# EAGLE design lens controller2 (EAGLE 6.1)
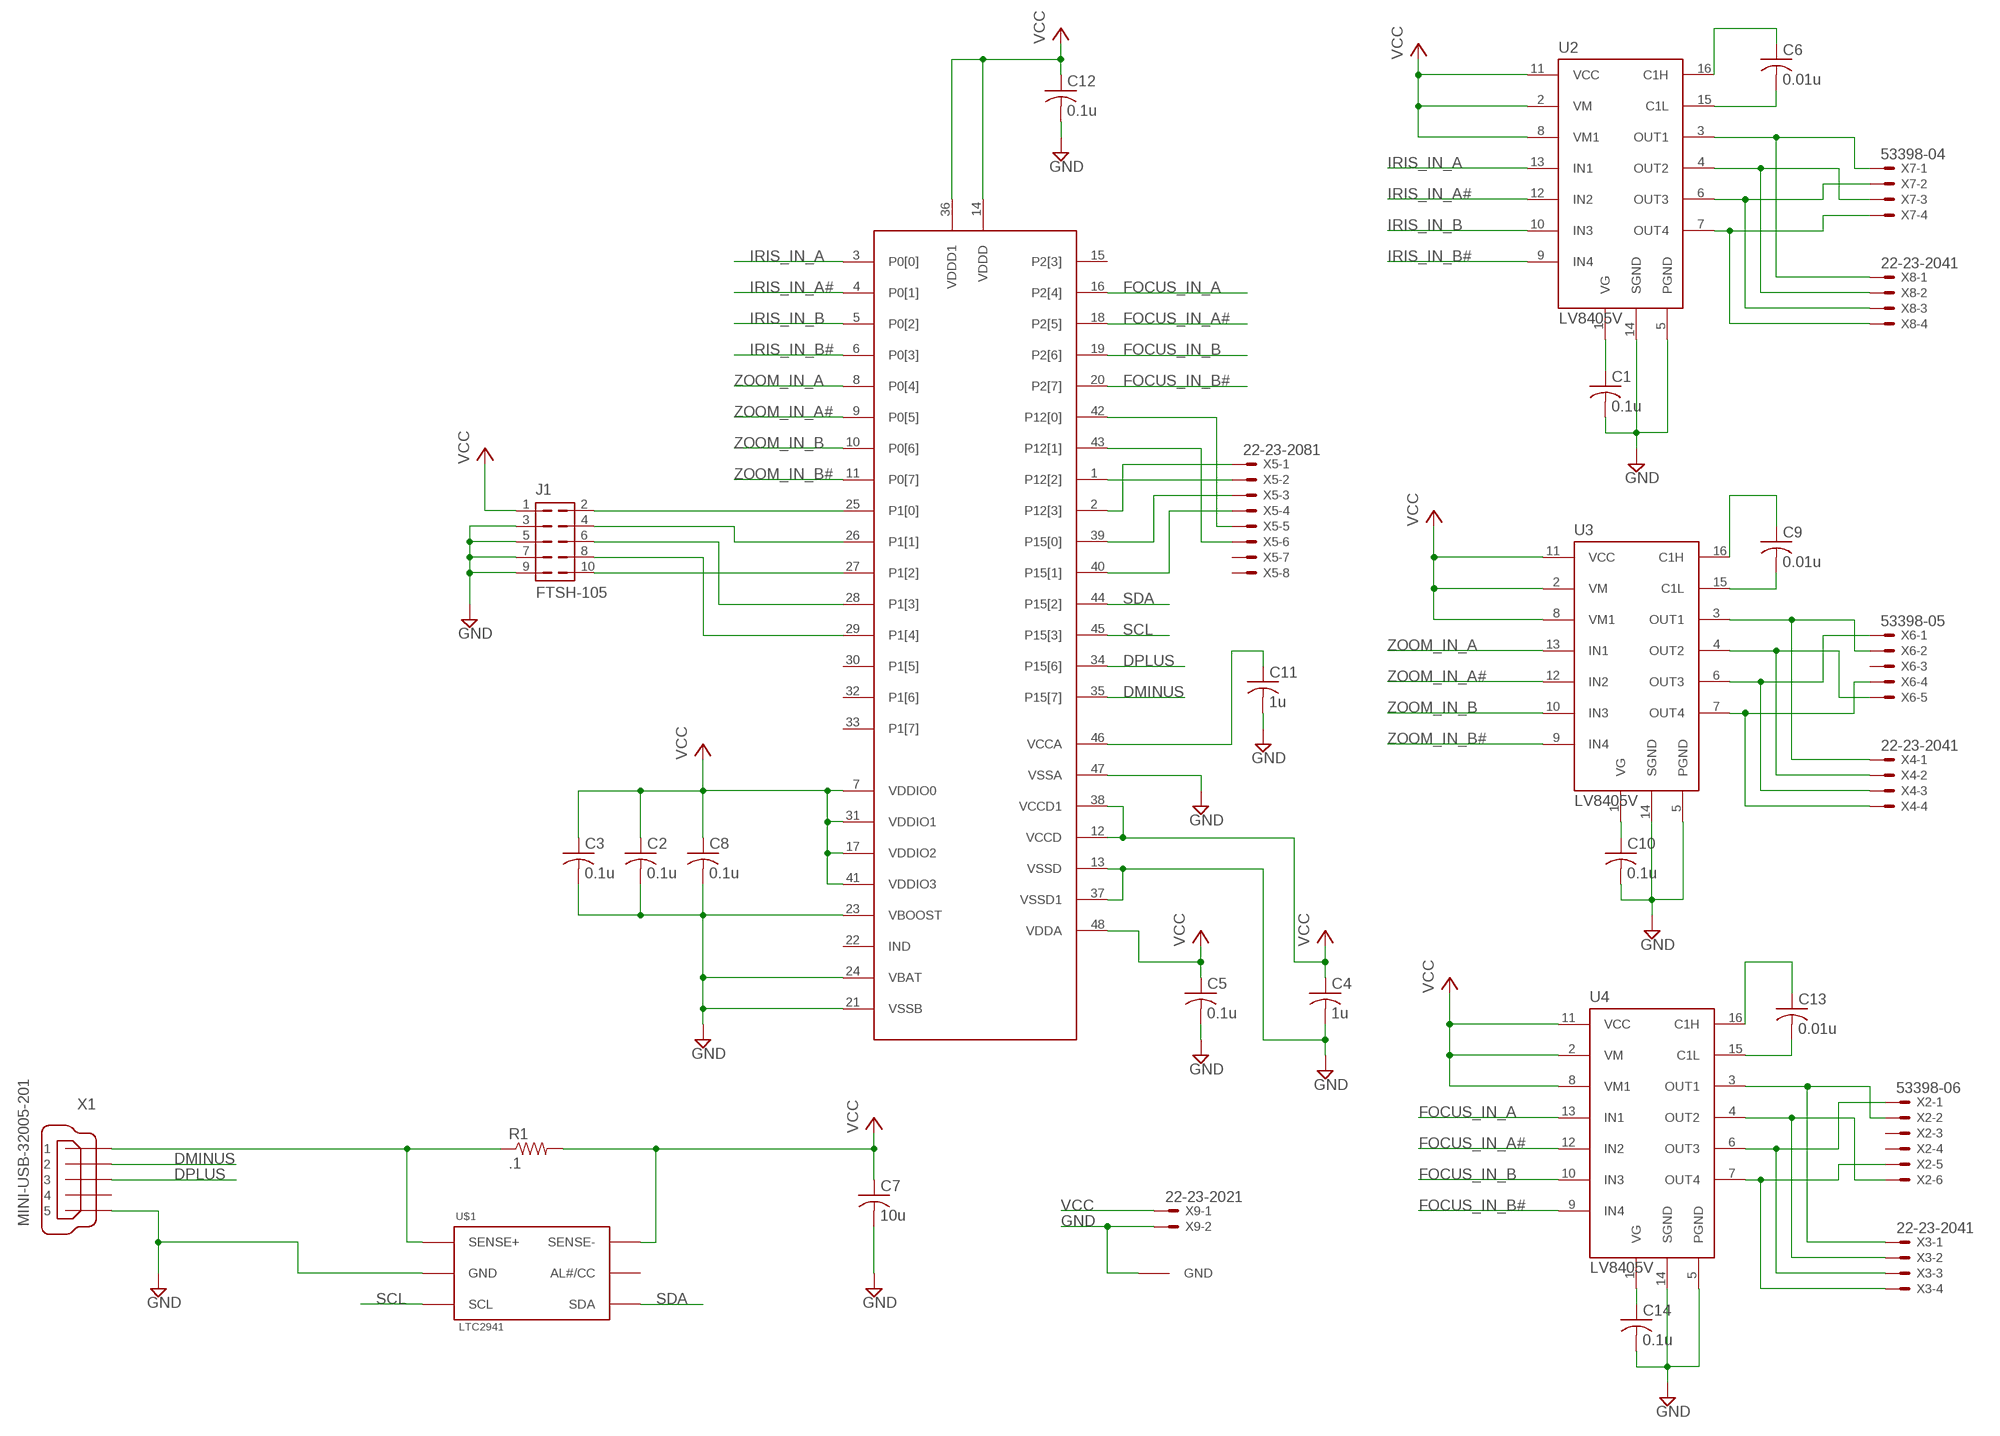
[diagram p0: schematic, sheet 1]

## Parts
C1  0.1u  C-USC1206  [C1206]
C2  0.1u  C-USC1206  [C1206]
C3  0.1u  C-USC1206  [C1206]
C4  1u  C-USC1206  [C1206]
C5  0.1u  C-USC1206  [C1206]
C6  0.01u  C-USC1206  [C1206]
C7  10u  C-USC1206  [C1206]
C8  0.1u  C-USC1206  [C1206]
C9  0.01u  C-USC1206  [C1206]
C10  0.1u  C-USC1206  [C1206]
C11  1u  C-USC1206  [C1206]
C12  0.1u  C-USC1206  [C1206]
C13  0.01u  C-USC1206  [C1206]
C14  0.1u  C-USC1206  [C1206]
J1  FTSH-105  [FTSH-105-01-XXX-DV-K]
R1  .1  R-US_M1206  [M1206]
U1  CY8C3246PVI  [SSOP48B]
U2  LV8405V  [SSOP16]
U3  LV8405V  [SSOP16]
U4  LV8405V  [SSOP16]
U$1  LTC2941  [DFN6-2X3]
U$5  GND_LUG  [GND_PAD]
X1  MINI-USB-32005-201  [32005-201]
X2  53398-06  [53398-06]
X3  22-23-2041  [22-23-2041]
X4  22-23-2041  [22-23-2041]
X5  22-23-2081  [22-23-2081]
X6  53398-05  [53398-05]
X7  53398-04  [53398-04]
X8  22-23-2041  [22-23-2041]
X9  22-23-2021  [22-23-2021]

## Nets
DMINUS: U1.35(P15[7]) X1.2
DPLUS: U1.34(P15[6]) X1.3
FOCUS_IN_A: U1.16(P2[4]) U4.13(IN1)
FOCUS_IN_A#: U1.18(P2[5]) U4.12(IN2)
FOCUS_IN_B: U1.19(P2[6]) U4.10(IN3)
FOCUS_IN_B#: U1.20(P2[7]) U4.9(IN4)
GND: C1.2 C2.2 C3.2 C4.2 C5.2 C7.2 C8.2 C10.2 C11.2 C12.2 C14.2 J1.3 J1.5 J1.7 J1.9 U1.13(VSSD) U1.21(VSSB) U1.23(VBOOST) U1.24(VBAT) U1.37(VSSD1) U1.47(VSSA) U2.5(PGND) U2.14(SGND) U3.5(PGND) U3.14(SGND) U4.5(PGND) U4.14(SGND) U$1.2(GND) U$5.P$1(GND) X1.5 X9.2
IRIS_IN_A: U1.3(P0[0]) U2.13(IN1)
IRIS_IN_A#: U1.4(P0[1]) U2.12(IN2)
IRIS_IN_B: U1.5(P0[2]) U2.10(IN3)
IRIS_IN_B#: U1.6(P0[3]) U2.9(IN4)
N$1: J1.2 U1.25(P1[0])
N$2: J1.4 U1.26(P1[1])
N$3: J1.10 U1.27(P1[2])
N$4: J1.6 U1.28(P1[3])
N$5: J1.8 U1.29(P1[4])
N$6: C11.1 U1.46(VCCA)
N$7: C6.2 U2.15(C1L)
N$8: C6.1 U2.16(C1H)
N$9: C1.1 U2.1(VG)
N$10: C9.2 U3.15(C1L)
N$11: C9.1 U3.16(C1H)
N$12: C10.1 U3.1(VG)
N$13: U2.3(OUT1) X7.1 X8.1
N$14: U2.4(OUT2) X7.3 X8.2
N$15: C13.2 U4.15(C1L)
N$16: C13.1 U4.16(C1H)
N$17: C14.1 U4.1(VG)
N$18: U2.6(OUT3) X7.2 X8.3
N$19: U2.7(OUT4) X7.4 X8.4
N$20: U3.3(OUT1) X4.1 X6.2
N$21: U3.4(OUT2) X4.2 X6.5
N$22: U3.6(OUT3) X4.3 X6.1
N$23: U3.7(OUT4) X4.4 X6.4
N$24: U4.3(OUT1) X2.2 X3.1
N$25: U4.4(OUT2) X2.6 X3.2
N$26: U4.6(OUT3) X2.1 X3.3
N$27: U4.7(OUT4) X2.5 X3.4
N$28: U1.43(P12[1]) X5.6
N$29: U1.42(P12[0]) X5.5
N$30: U1.40(P15[1]) X5.4
N$31: U1.39(P15[0]) X5.3
N$32: U1.2(P12[3]) X5.1
N$33: U1.1(P12[2]) X5.2
N$38: R1.1 U$1.1(SENSE+) X1.1
SCL: U1.45(P15[3]) U$1.3(SCL)
SDA: U1.44(P15[2]) U$1.4(SDA)
VCC: C2.1 C3.1 C4.1 C5.1 C7.1 C8.1 C12.1 J1.1 R1.2 U1.7(VDDIO0) U1.12(VCCD) U1.14(VDDD) U1.17(VDDIO2) U1.31(VDDIO1) U1.36(VDDD1) U1.38(VCCD1) U1.41(VDDIO3) U1.48(VDDA) U2.2(VM) U2.8(VM1) U2.11(VCC) U3.2(VM) U3.8(VM1) U3.11(VCC) U4.2(VM) U4.8(VM1) U4.11(VCC) U$1.6(SENSE-) X9.1
ZOOM_IN_A: U1.8(P0[4]) U3.13(IN1)
ZOOM_IN_A#: U1.9(P0[5]) U3.12(IN2)
ZOOM_IN_B: U1.10(P0[6]) U3.10(IN3)
ZOOM_IN_B#: U1.11(P0[7]) U3.9(IN4)
Unconnected: U1.15(P2[3]) U1.22(IND) U1.30(P1[5]) U1.32(P1[6]) U1.33(P1[7]) U$1.5(AL#/CC) X1.4 X2.3 X2.4 X5.7 X5.8 X6.3

## Library data of the parts
C1-C14 = resistor:C-US: CAPACITOR, American symbol
J1 = NicksParts:FTSH-105
R1 = resistor:R-US_: RESISTOR, American symbol
U1 = NicksParts:CY8C3246PVI
U2-U4 = NicksParts:LV8405V
U$1 = NicksParts:LTC2941
U$5 = NicksParts:GND_LUG
X1 = con-cypressindustries:MINI-USB-: MINI USB-B Conector Source: www.cypressindustries.com; OC_FARNELL: unknown; OC_NEWARK: unknown
X2 = con-molex:53?-06: CONNECTOR wire to board 1.25 mm (.049 inch) pitch header; OC_FARNELL: 1125368; OC_NEWARK: unknown
X3 X4 X8 = con-molex:22-23-2041: .100" (2.54mm) Center Header - 4 Pin; MF: MOLEX; MPN: 22-23-2041; OC_FARNELL: 1462920; OC_NEWARK: 38C0355
X5 = con-molex:22-23-2081: .100" (2.54mm) Center Header - 8 Pin; MF: MOLEX; MPN: 22-23-2081; OC_FARNELL: 1756826; OC_NEWARK: 01C7592
X6 = con-molex:53?-05: CONNECTOR wire to board 1.25 mm (.049 inch) pitch header; OC_FARNELL: 1125354; OC_NEWARK: unknown
X7 = con-molex:53?-04: CONNECTOR wire to board 1.25 mm (.049 inch) pitch header; OC_FARNELL: 1125367; OC_NEWARK: unknown
X9 = con-molex:22-23-2021: .100" (2.54mm) Center Header - 2 Pin; MF: MOLEX; MPN: 22-23-2021; OC_FARNELL: 1462926; OC_NEWARK: 25C3832

## Board
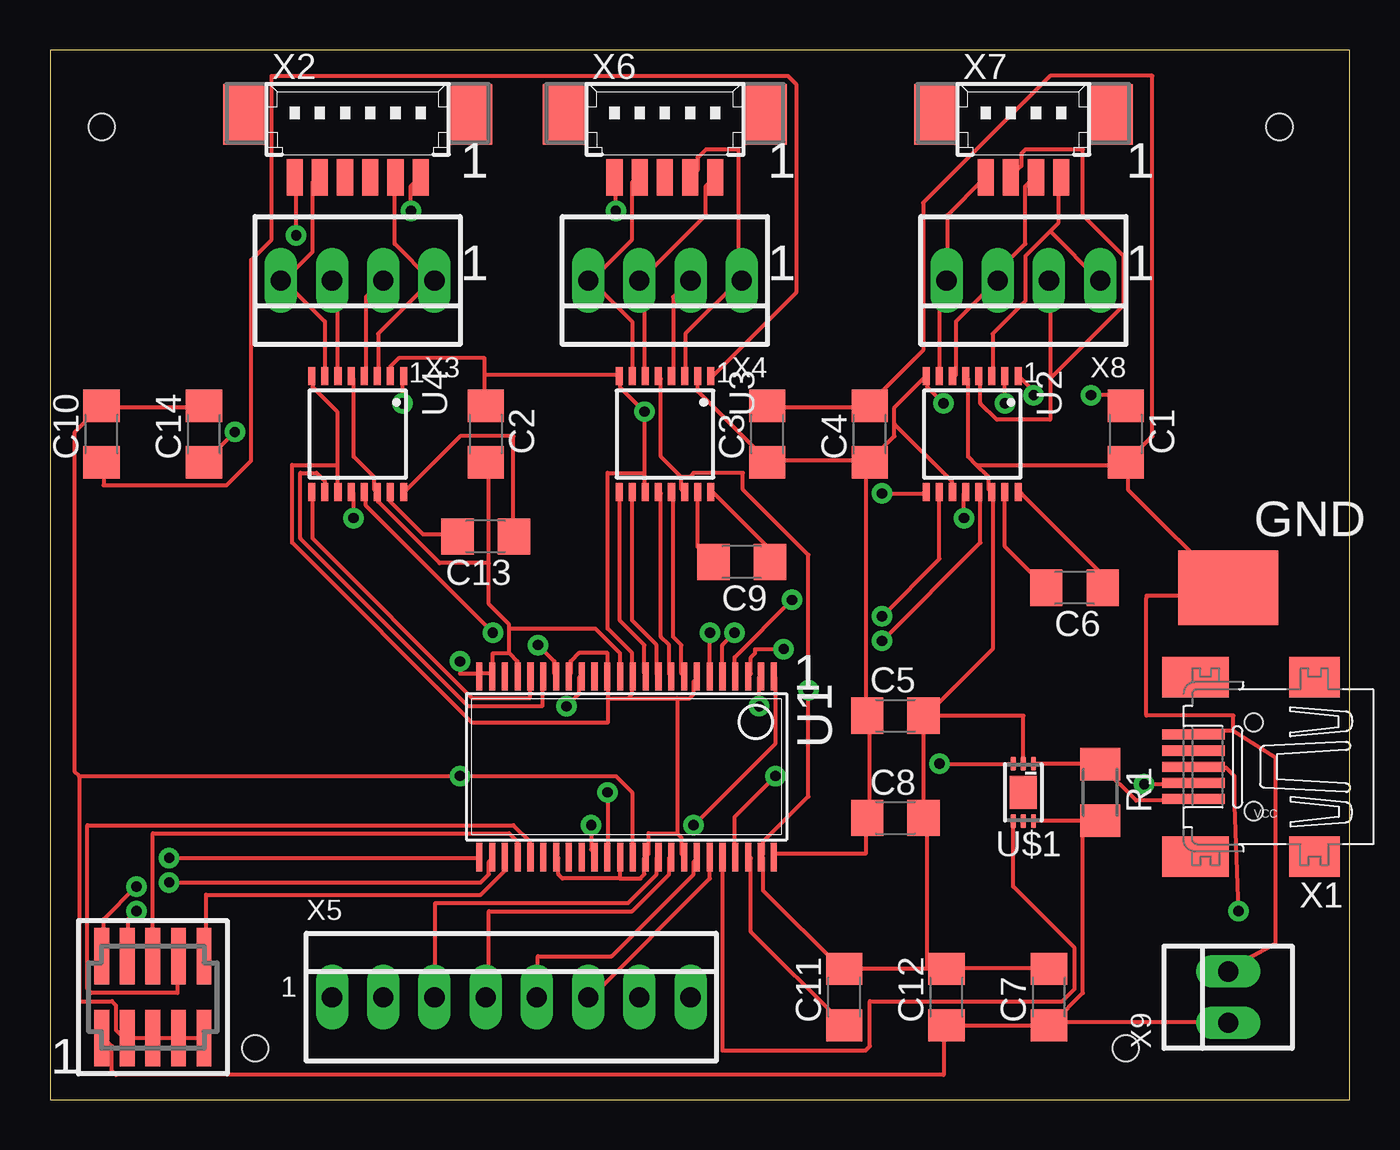
[diagram p1: board, top side]
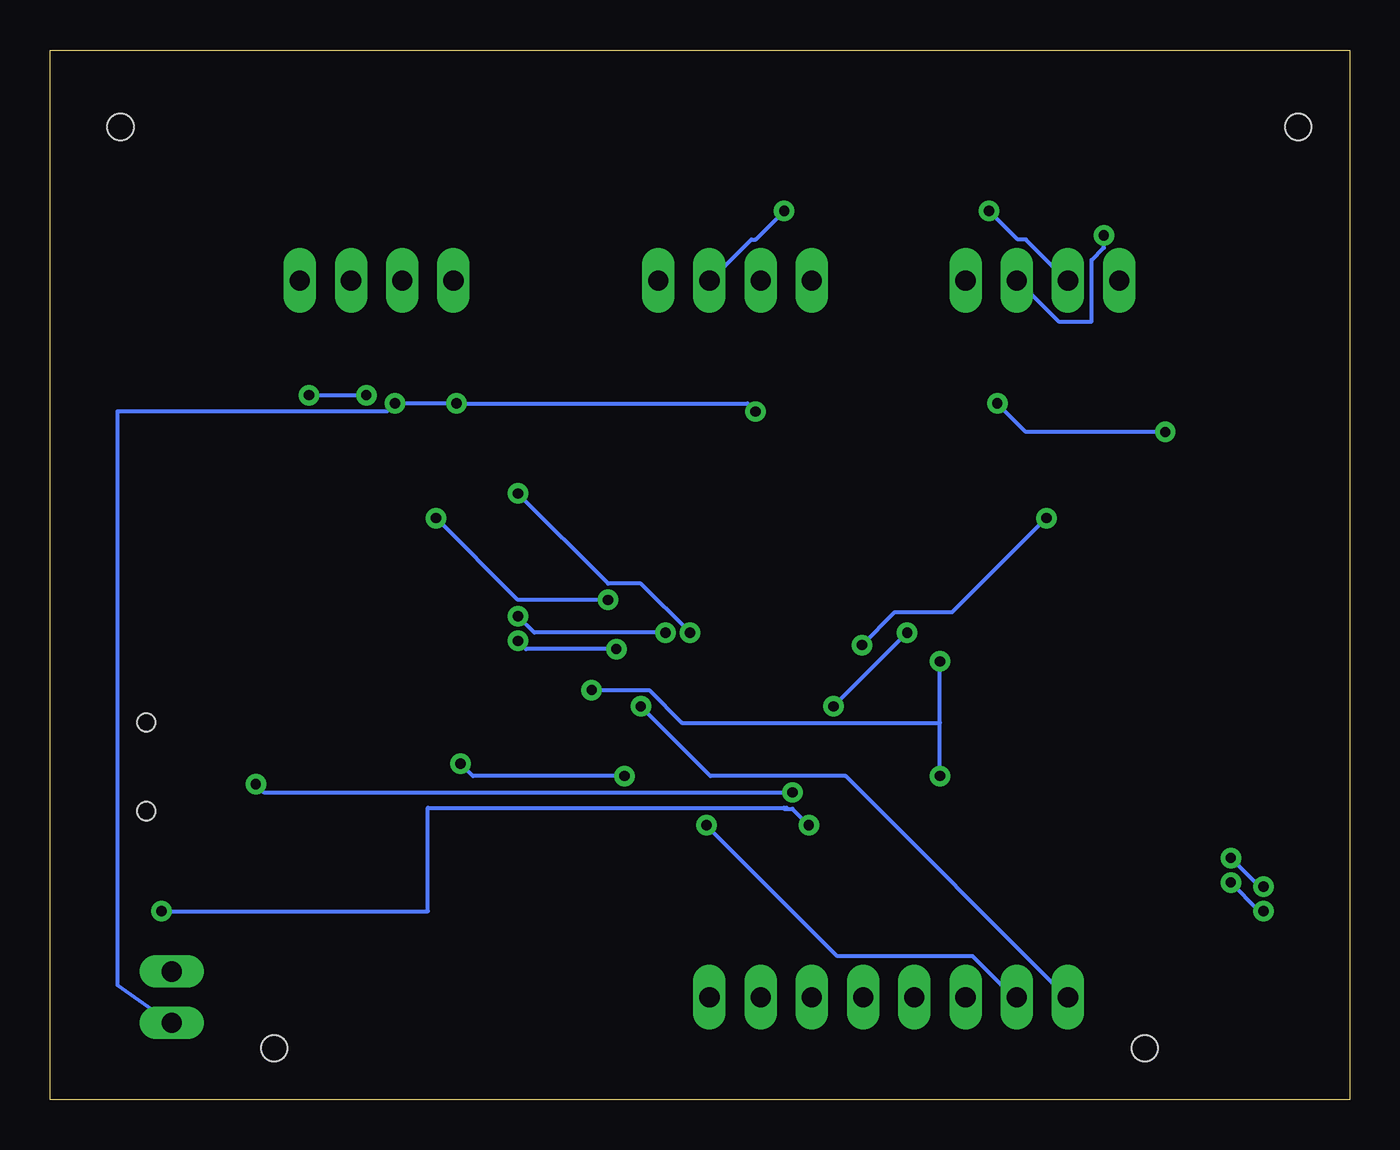
[diagram p2: board, bottom side, seen from below]

Size 64.44 x 52.06 mm. Coordinates in mm from the lower left corner, seen from the top.
Outline: 0,0 64.44,0 64.44,52.06 0,52.06 0,0
Copper layers (1*16): Top 0.035mm / dielectric 1.5mm / Bottom 0.035mm
Design rules: minimum track width 8mil, minimum drill 20mil, track to track 8mil, track to pad 8mil, pad to pad 8mil, via to via 8mil, smd to smd 8mil, copper to edge 10mil, drill to drill 8mil, minimum pad ring 12mil, minimum via ring 10mil, stop-mask expansion 4mil, vias tented up to drill 25mil, thermal gap 10mil
Holes 1.3 mm at 2.54,48.26 60.96,48.26 53.34,2.54 10.16,2.54

### Footprints (pad centres in the part's own frame; a part is rotated, then mirrored left to right if it is on the bottom)
C1206 = smd 1.6 x 1.8: 1 -1.4,0; 2 1.4,0
FTSH-105-01-XXX-DV-K = smd 0.737 x 2.794: 1 -2.54,-2.032; 2 -2.54,2.032; 3 -1.27,-2.032; 4 -1.27,2.032; 5 0,-2.032; 6 0,2.032; 7 1.27,-2.032; 8 1.27,2.032; 9 2.54,-2.032; 10 2.54,2.032
M1206 = smd 1.6 x 2: 1 -1.4,0; 2 1.4,0
SSOP48B = smd 0.305 x 1.397: 1 -6.668,-4.483; 2 -6.032,-4.483; 3 -5.397,-4.483; 4 -4.763,-4.483; 5 -4.128,-4.483; 6 -3.493,-4.483; 7 -2.857,-4.483; 8 -2.223,-4.483; 9 -1.587,-4.483; 10 -0.953,-4.483; 11 -0.318,-4.483; 12 0.318,-4.483; 13 0.953,-4.483; 14 1.587,-4.483; 15 2.223,-4.483; 16 2.857,-4.483; 17 3.493,-4.483; 18 4.128,-4.483; 19 4.763,-4.483; 20 5.397,-4.483; 21 6.032,-4.483; 22 6.668,-4.483; 23 7.303,-4.483; 24 7.938,-4.483; 25 7.938,4.483; 26 7.303,4.483; 27 6.668,4.483; 28 6.032,4.483; 29 5.397,4.483; 30 4.763,4.483; 31 4.128,4.483; 32 3.493,4.483; 33 2.857,4.483; 34 2.223,4.483; 35 1.587,4.483; 36 0.953,4.483; 37 0.318,4.483; 38 -0.318,4.483; 39 -0.953,4.483; 40 -1.587,4.483; 41 -2.223,4.483; 42 -2.857,4.483; 43 -3.493,4.483; 44 -4.128,4.483; 45 -4.763,4.483; 46 -5.397,4.483; 47 -6.032,4.483; 48 -6.668,4.483
SSOP16 = smd 0.9 x 0.35: 1 -2.875,2.275; 2 -2.875,1.625; 3 -2.875,0.975; 4 -2.875,0.325; 5 -2.875,-0.325; 6 -2.875,-0.975; 7 -2.875,-1.625; 8 -2.875,-2.275; 9 2.875,-2.275; 10 2.875,-1.625; 11 2.875,-0.975; 12 2.875,-0.325; 13 2.875,0.325; 14 2.875,0.975; 15 2.875,1.625; 16 2.875,2.275
DFN6-2X3 = smd 0.25 x 0.7: 1 -0.5,-1.425; 2 0,-1.425; 3 0.5,-1.425; 4 0.5,1.425; 5 0,1.425; 6 -0.5,1.425 | smd 1.35 x 1.65: EXP 0,0
GND_PAD = smd 4.953 x 3.683: P$1 0,0
32005-201 = smd 3.1 x 0.5: 1 3,1.6; 2 3,0.8; 3 3,0; 4 3,-0.8; 5 3,-1.6 | smd 2.5 x 2: M1 -3,-4.45; M2 -3,4.45 | smd 3.3 x 2: M3 2.9,4.45; M4 2.9,-4.45 | hole 0.9: 0,2.2; 0,-2.2
53398-06 = smd 0.8 x 1.8: 1 3.125,-2.5; 2 1.875,-2.5; 3 0.625,-2.5; 4 -0.625,-2.5; 5 -1.875,-2.5; 6 -3.125,-2.5 | smd 2.1 x 3: S1 5.625,0.625; S2 -5.625,0.625
22-23-2041 = drill 1 long: 1 -3.81,0; 2 -1.27,0; 3 1.27,0; 4 3.81,0
22-23-2081 = drill 1 long: 1 -8.89,0; 2 -6.35,0; 3 -3.81,0; 4 -1.27,0; 5 1.27,0; 6 3.81,0; 7 6.35,0; 8 8.89,0
53398-05 = smd 0.8 x 1.8: 1 2.5,-2.5; 2 1.25,-2.5; 3 0,-2.5; 4 -1.25,-2.5; 5 -2.5,-2.5 | smd 2.1 x 3: S1 5,0.625; S2 -5,0.625
53398-04 = smd 0.8 x 1.8: 1 1.875,-2.5; 2 0.625,-2.5; 3 -0.625,-2.5; 4 -1.875,-2.5 | smd 2.1 x 3: S1 4.375,0.625; S2 -4.375,0.625
22-23-2021 = drill 1 long: 1 -1.27,0; 2 1.27,0

### Placement (x,y rotation side)
C1  53.34,33.02 270 top
C2  21.59,33.02 270 top
C3  35.56,33.02 90 top
C4  40.64,33.02 90 top
C5  41.91,19.05 0 top
C6  50.8,25.4 180 top
C7  49.53,5.08 90 top
C8  41.91,13.97 0 top
C9  34.29,26.67 180 top
C10  2.54,33.02 90 top
C11  39.37,5.08 90 top
C12  44.45,5.08 90 top
C13  21.59,27.94 180 top
C14  7.62,33.02 90 top
J1  5.08,5.08 0 top
R1  52.07,15.24 270 top
U1  29.21,16.51 180 top
U2  45.72,33.02 270 top
U3  30.48,33.02 270 top
U4  15.24,33.02 270 top
U$1  48.26,15.24 180 top
U$5  58.42,25.4 0 top
X1  59.69,16.51 180 top
X2  15.24,48.26 0 top
X3  15.24,40.64 180 top
X4  30.48,40.64 180 top
X5  22.86,5.08 0 top
X6  30.48,48.26 0 top
X7  48.26,48.26 0 top
X8  48.26,40.64 180 top
X9  58.42,5.08 90 top

### Tracks (layer width: path | path; a pad name or v marks a point on that pad's centre or on a via)
DMINUS  (via drill 0.51)
  Top 0.203: v27.64,15.24 27.64,12.19 U1.35 | v54.25,15.65 56.49,15.65 X1.2
  Bottom 0.203: v27.64,15.24 53.85,15.24 v54.25,15.65
DPLUS  (via drill 0.51)
  Top 0.203: v26.82,13.61 26.82,12.39 27.03,12.19 U1.34 | v58.93,9.35 58.73,14.63 58.73,16.05 58.32,16.46 56.69,16.46 X1.3
  Bottom 0.203: v26.82,13.61 27.64,14.43 28.04,14.43 28.04,14.48 | v58.93,9.35 45.72,9.35 45.72,14.48 28.04,14.48 | 28.04,14.48 27.94,14.48
FOCUS_IN_A  (via drill 0.51)
  Top 0.203: v21.95,23.16 15.65,29.46 15.65,30.07 U4.13 | v25.6,19.51 26.21,20.12 26.21,20.93 U1.16
  Bottom 0.203: v25.6,19.51 v21.95,23.16
FOCUS_IN_A#  (via drill 0.51)
  Top 0.203: v15.04,28.85 15.04,30.07 U4.12 | v24.18,22.55 24.99,21.74 24.99,21.13 U1.18
  Bottom 0.203: v15.04,28.85 19.71,24.18 22.55,24.18 v24.18,22.55
FOCUS_IN_B
  Top 0.203: U4.10 13.61,30.28 13.61,30.68 13.21,31.09 12.39,31.09 12.39,27.84 20.73,19.51 24.38,19.51 24.38,20.93 U1.19
FOCUS_IN_B#
  Top 0.203: U4.9 13.01,30.07 13.01,27.84 20.93,19.91 23.77,19.91 23.77,20.93 U1.20
GND  (via drill 0.51)
  Top 0.203: U4.5 15.04,35.76 15.04,31.9 16.05,30.89 16.05,30.28 U4.14 16.26,30.07 16.26,29.67 19.3,26.62 21.74,26.62 | 21.95,21.13 21.34,21.13 U1.24 21.13,21.13 20.32,21.13 v20.32,21.74 | 21.95,21.13 U1.23 21.95,21.13 | 22.76,22.15 23.16,21.74 23.16,21.13 U1.21 | 22.76,22.15 21.95,22.15 21.95,21.13 | 22.76,23.37 27.03,23.37 28.25,22.15 28.25,21.13 U1.13 | 22.76,22.15 22.76,23.37 | 21.74,26.62 21.74,24.59 22.76,23.57 22.76,23.37 | 21.74,26.62 21.74,31.5 C2.2 | C14.2 7.52,34.34 2.64,34.34 C10.2 2.44,34.34 1.22,33.12 1.22,16.26 1.42,16.05 | 6.5,3.05 J1.7 | 7.52,3.05 J1.9 7.52,3.05 | 1.42,16.05 v20.32,16.05 28.04,16.05 28.85,15.24 28.85,12.19 U1.37 | 3.86,3.05 J1.3 | C5.2 43.28,18.9 43.28,14.02 C8.2 43.48,13.82 43.48,6.5 | C7.2 49.38,6.5 44.5,6.5 C12.2 44.3,6.5 43.48,6.5 | 31.29,30.89 30.28,31.9 30.28,35.76 U3.5 | 31.29,30.89 31.29,30.28 U3.14 | 31.29,30.89 31.7,30.89 31.9,31.09 34.34,31.09 34.34,30.28 37.59,27.03 v37.59,20.32 37.59,15.04 35.36,12.8 35.36,12.19 U1.47 35.36,11.99 35.36,10.36 39.22,6.5 C11.2 39.42,6.5 43.48,6.5 | 58.67,18.29 56.69,18.29 X1.5 | 58.67,18.29 60.76,16.97 60.76,7.72 58.52,6.5 X9.2 | C3.2 35.56,34.34 40.64,34.34 C4.2 40.64,34.54 43.28,37.19 43.28,44.5 49.58,50.8 54.66,50.8 54.66,32.92 53.44,31.7 C1.2 | 45.92,31.5 46.53,30.89 46.53,30.28 U2.14 46.74,30.07 46.74,22.35 43.48,19.1 | 45.92,31.5 45.52,31.9 45.52,35.76 U2.5 | 45.92,31.5 53.24,31.5 C1.2 | C1.2 53.44,31.5 53.44,30.28 58.32,25.4 U$5.P$1 58.52,25.4 58.93,24.99 54.36,24.99 54.36,24.89 54.36,19.05 58.67,19.05 58.67,18.29 | 43.48,19.1 C5.2 | U$1.2 48.26,19.05 43.48,19.05 | 43.43,19.05 43.48,19.05
  Top 0.203: 43.48,19.1 43.48,19.05 | 43.48,19.1 C5.2 | 3.86,3.05 J1.5 6.3,3.05 J1.7 | 3.86,3.05 J1.3 | 7.52,3.05 6.5,3.05 | 6.5,3.05 J1.7 | 1.42,16.05 1.42,4.88 3.05,4.88 3.25,4.67 3.25,3.45 3.66,3.05 J1.3
  Bottom 0.203: v20.32,16.05 20.32,18.69 | 20.32,18.69 v20.32,21.74 | 20.32,18.69 33.12,18.69 34.75,20.32 v37.59,20.32
IRIS_IN_A  (via drill 0.51)
  Top 0.203: v41.25,22.76 46.13,27.64 46.13,30.07 U2.13 | v36.37,22.35 34.95,22.35 34.95,22.15 34.75,21.95 34.75,21.13 U1.3
  Bottom 0.203: v41.25,22.76 40.84,22.35 v36.37,22.35
IRIS_IN_A#  (via drill 0.51)
  Top 0.203: v45.31,28.85 45.31,30.07 U2.12 | v36.78,24.79 33.93,21.95 33.93,21.13 U1.4
  Bottom 0.203: v45.31,28.85 41.25,24.79 v36.78,24.79
IRIS_IN_B  (via drill 0.51)
  Top 0.203: v41.25,23.98 44.09,26.82 44.09,30.07 U2.10 | v33.93,23.16 33.33,22.55 33.33,21.13 U1.5
  Bottom 0.203: v41.25,23.98 40.44,23.16 v33.93,23.16
IRIS_IN_B#  (via drill 0.51)
  Top 0.203: v41.25,30.07 43.28,30.07 U2.9 | v32.72,23.16 32.72,21.13 U1.6
  Bottom 0.203: v41.25,30.07 36.78,25.6 35.15,25.6 v32.72,23.16
N$1  (via drill 0.51)
  Top 0.203: v5.89,11.99 21.13,11.99 U1.25 | v4.27,10.57 2.64,8.94 2.64,7.11 J1.2
  Bottom 0.203: v5.89,11.99 4.47,10.57 v4.27,10.57
N$2  (via drill 0.51)
  Top 0.203: v5.89,10.77 21.34,10.77 21.74,11.18 21.74,11.79 21.95,11.99 U1.26 | v4.27,9.35 3.86,8.94 3.86,7.11 J1.4
  Bottom 0.203: v5.89,10.77 4.47,9.35 v4.27,9.35
N$3
  Top 0.203: U1.27 22.55,11.99 22.55,11.38 21.34,10.16 7.72,10.16 7.72,7.11 J1.10
N$4
  Top 0.203: J1.6 5.08,13.21 22.76,13.21 23.16,12.8 23.16,12.19 U1.28
N$5
  Top 0.203: U1.29 23.77,12.19 23.77,12.8 22.96,13.61 1.83,13.61 1.83,5.49 2.03,5.28 6.3,5.28 6.3,7.11 J1.8
N$6
  Top 0.203: U1.46 34.75,11.99 34.75,8.33 39.22,3.86 C11.1
N$7
  Top 0.203: U2.15 47.35,30.07 47.35,27.43 49.38,25.4 C6.2
N$8
  Top 0.203: U2.16 48.16,30.07 52.02,26.21 52.02,25.4 C6.1
N$9  (via drill 0.51)
  Top 0.203: v48.77,34.95 48.77,35.15 48.16,35.76 U2.1 | v51.61,34.95 53.24,34.95 53.24,34.54 C1.1
  Bottom 0.203: v51.61,34.95 v48.77,34.95
N$10
  Top 0.203: U3.15 32.11,30.07 32.11,27.43 32.72,26.82 C9.2
N$11
  Top 0.203: U3.16 32.92,30.07 35.56,27.43 35.56,26.82 C9.1
N$12
  Top 0.203: U3.1 32.92,35.97 36.98,40.03 36.98,50.39 36.58,50.8 10.97,50.8 10.97,42.67 9.96,41.66 9.96,31.7 8.74,30.48 2.64,30.48 2.64,31.5 C10.1
N$13
  Top 0.203: 49.58,43.08 49.99,43.48 49.99,45.72 X7.1 | 49.58,43.08 48.36,41.86 48.36,39.62 46.74,38 46.74,35.97 U2.3 | 49.58,43.08 52.02,40.64 X8.1
N$14
  Top 0.203: 49.58,35.76 49.58,40.64 X8.2 | 49.58,35.76 49.58,33.73 46.94,33.73 46.13,34.54 46.13,35.76 U2.4 | 49.58,35.76 53.24,39.42 53.24,41.86 51.21,43.89 51.21,47.14 48.36,47.14 48.16,46.94 48.16,46.33 47.75,45.92 X7.3
N$15
  Top 0.203: U4.15 16.87,30.07 16.87,29.67 18.49,28.04 20.12,28.04 C13.2
N$16
  Top 0.203: U4.16 17.68,30.28 20.32,32.92 22.96,32.92 22.96,28.04 C13.1
N$17  (via drill 0.51)
  Top 0.203: v17.48,34.54 17.48,35.76 U4.1 | v9.14,33.12 7.72,31.7 C14.1
  Bottom 0.203: v17.48,34.54 16.05,33.12 v9.14,33.12
N$18
  Top 0.203: U2.6 44.91,35.97 44.91,38.61 46.94,40.64 X8.3 47.14,40.64 47.14,41.25 48.36,42.47 48.36,45.31 48.77,45.72 X7.2
N$19
  Top 0.203: U2.7 44.09,35.97 44.09,40.44 44.3,40.64 X8.4 44.5,40.64 44.5,43.89 46.33,45.72 X7.4
N$20
  Top 0.203: 34.14,40.64 31.5,38 31.5,35.97 U3.3 | 34.14,40.64 X4.1 34.14,40.64 | 34.14,40.64 34.14,47.14 32.51,47.14 32.11,46.74 32.11,46.13 31.9,45.92 X6.2
N$21  (via drill 0.51)
  Top 0.203: U3.4 30.89,35.97 30.89,39.83 31.7,40.64 X4.2 | v28.04,44.09 28.04,45.72 X6.5
  Bottom 0.203: v28.04,44.09 29.46,42.67 29.67,42.67 31.7,40.64 X4.2
N$22
  Top 0.203: 29.26,40.64 29.46,40.44 29.46,35.97 U3.6 | 29.26,40.64 X4.3 29.26,40.64 | 29.26,40.64 32.51,43.89 32.51,45.31 32.92,45.72 X6.1
N$23
  Top 0.203: 26.82,40.64 28.85,38.61 28.85,35.97 U3.7 | 26.82,40.64 X4.4 26.82,40.64 | 26.82,40.64 28.85,42.67 28.85,45.52 29.06,45.72 X6.4
N$24
  Top 0.203: 18.9,40.64 16.26,38 16.26,35.97 U4.3 | 18.9,40.64 X3.1 18.9,40.64 | 18.9,40.64 17.07,42.47 17.07,45.72 X2.2
N$25  (via drill 0.51)
  Top 0.203: U4.4 15.65,35.97 15.65,39.83 16.46,40.64 X3.2 | v12.19,42.88 12.19,45.72 X2.6
  Bottom 0.203: v12.19,42.88 12.19,42.27 12.8,41.66 12.8,38.61 14.43,38.61 16.46,40.64 X3.2
N$26  (via drill 0.51)
  Top 0.203: U4.6 14.22,35.97 14.22,40.44 14.02,40.64 X3.3 | v17.88,44.09 17.88,45.31 18.29,45.72 X2.1
  Bottom 0.203: v17.88,44.09 16.46,42.67 16.05,42.67 14.02,40.64 X3.3
N$27
  Top 0.203: 11.58,40.64 13.61,38.61 13.61,35.97 U4.7 | 11.58,40.64 X3.4 11.58,40.64 | 11.58,40.64 13.01,42.06 13.01,45.52 13.21,45.72 X2.5
N$28
  Top 0.203: U1.43 32.72,11.99 32.72,10.97 26.82,5.08 X5.6
N$29
  Top 0.203: U1.42 32.11,11.99 31.9,11.79 31.9,11.18 27.84,7.11 24.18,7.11 24.18,5.08 X5.5
N$30
  Top 0.203: U1.40 30.68,11.99 30.68,11.18 28.85,9.35 21.74,9.35 21.74,5.08 X5.4
N$31
  Top 0.203: U1.39 30.07,11.99 30.07,11.18 28.65,9.75 19.1,9.75 19.1,5.08 X5.3
N$32  (via drill 0.51)
  Top 0.203: v35.15,19.51 35.15,20.93 U1.2
  Bottom 0.203: v35.15,19.51 31.7,16.05 24.99,16.05 14.02,5.08 X5.1
N$33  (via drill 0.51)
  Top 0.203: v31.9,13.61 35.97,17.68 35.97,20.93 U1.1
  Bottom 0.203: v31.9,13.61 25.4,7.11 18.69,7.11 16.66,5.08 X5.2
N$38
  Top 0.203: U$1.1 52.02,16.66 R1.1 52.22,16.46 53.85,14.83 56.49,14.83 X1.1
SCL  (via drill 0.51)
  Top 0.203: v44.09,16.66 U$1.3 | v35.97,16.05 33.93,14.02 33.93,12.19 U1.45
  Bottom 0.203: v44.09,16.66 43.48,16.05 v35.97,16.05
SDA
  Top 0.203: U$1.4 47.75,13.61 47.75,10.57 50.8,7.52 50.8,5.49 50.19,4.88 40.64,4.88 40.64,2.64 40.44,2.44 33.33,2.44 33.33,11.99 U1.44
VCC  (via drill 0.51)
  Top 0.203: 21.54,35.97 21.54,34.54 C2.1 | 21.54,35.97 21.54,36.78 17.27,36.78 16.87,36.37 16.87,35.97 U4.2 | 21.54,35.97 28.04,35.97 U3.8 28.25,35.76 28.25,35.36 v29.46,34.14 29.46,31.09 | 29.46,31.09 29.46,30.28 U3.11 | 28.25,10.97 25.4,10.97 25.2,11.18 25.2,11.99 U1.31 | 28.25,10.97 28.25,11.99 U1.36 | 28.25,10.97 29.26,10.97 29.46,11.18 29.46,11.99 U1.38 29.67,12.19 29.67,13.21 31.09,13.21 | 31.09,13.21 31.29,13.01 31.29,12.19 U1.41 | 14.22,31.5 14.22,34.14 13.01,35.36 13.01,35.76 U4.8 | 14.22,31.5 14.22,30.28 U4.11 | U1.17 25.81,21.13 25.81,21.74 26.21,22.15 27.64,22.15 27.64,21.13 U1.14 27.64,20.93 27.64,19.91 | 28.65,19.91 28.85,20.12 28.85,20.93 U1.12 28.85,21.13 28.85,22.15 27.64,23.37 27.64,31.09 29.46,31.09 | 27.64,19.91 28.65,19.91 | 28.65,19.91 31.09,19.91 | 31.09,19.91 31.7,19.91 31.9,20.12 31.9,20.73 32.11,20.93 U1.7 | 14.22,31.5 11.99,31.5 11.99,27.64 20.93,18.69 27.64,18.69 27.64,19.91 | 31.09,19.91 31.09,13.21 | 51.21,13.82 52.02,13.82 R1.2 51.21,13.82 | 51.21,13.82 U$1.6 | C7.1 49.38,3.66 44.5,3.66 C12.1 44.3,3.66 44.3,1.22 3.25,1.22 3.05,1.42 3.05,2.64 2.64,3.05 J1.1 | 51.21,13.82 51.21,5.28 49.78,3.86 | 49.78,3.86 49.58,3.66 C7.1 | 49.78,3.86 58.32,3.86 X9.1 | 49.78,3.86 C7.1 | U1.48 35.97,12.19 40.44,12.19 40.44,13.82 C8.1 40.64,14.02 40.64,18.9 C5.1 40.44,19.1 40.44,31.7 | 35.56,31.7 32.11,35.15 32.11,35.76 U3.2 | 35.56,31.7 C3.1 35.56,31.7 | 41.86,33.53 41.86,32.92 40.64,31.7 | 41.86,33.53 41.86,34.34 43.28,35.76 U2.8 43.48,35.76 43.48,35.36 v44.3,34.54 | 40.64,31.7 C4.1 | 41.86,33.53 44.7,30.68 44.7,30.28 U2.11 | v47.35,34.54 47.35,35.76 U2.2 | 40.64,31.7 40.44,31.7
  Top 0.203: 40.44,31.7 35.56,31.7 | 40.64,31.7 C4.1 | 40.44,31.7 C4.1
  Bottom 0.203: X9.1 58.52,3.86 61.11,5.69 61.11,34.14 47.75,34.14 v47.35,34.54 v44.3,34.54 29.87,34.54 v29.46,34.14
ZOOM_IN_A
  Top 0.203: U3.13 30.89,30.07 30.89,22.96 31.29,22.55 31.29,21.13 U1.8
ZOOM_IN_A#
  Top 0.203: U3.12 30.28,30.07 30.28,22.96 30.68,22.55 30.68,21.13 U1.9
ZOOM_IN_B
  Top 0.203: U3.10 28.85,30.07 28.85,23.77 30.07,22.55 30.07,21.13 U1.10
ZOOM_IN_B#
  Top 0.203: U3.9 28.25,30.07 28.25,23.77 29.46,22.55 29.46,21.13 U1.11

### Text on the board
tNames: 1 | 1 | 1 | 1 | 1 | 1 | 1 | 1 | 1 | GND | 1 | VCC | 1 | 1